# Altium schematic sheet 3.3V_REG_EN.SchDoc
size A4
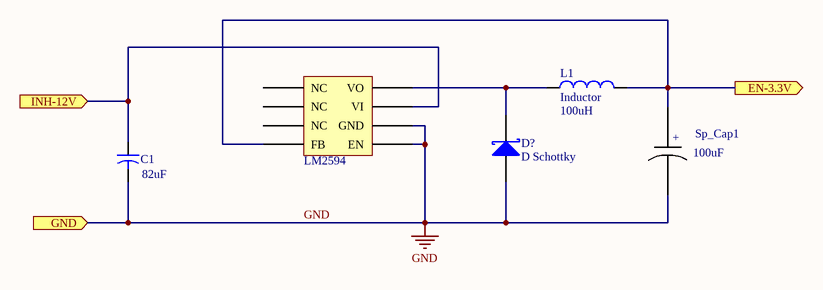
[diagram p0: 3.3V_REG_EN.SchDoc]

## Parts
C1  value 82uF  [CAPR5-4X5]  (hidden comment: Cap2)
D?  D Schottky  [SMB]
L1  Inductor  value 100uH  [0402-A]
LM2594  LM2594  [SOIC8-LM2594]  (value not drawn)
Sp_Cap1  value 100uF  (hidden comment: Sprague_capacitor)

## Ports
EN-3.3V (out), GND (in), INH-12V (in)

## Nets
GND: C1.2 D?.1(A) LM2594.EN LM2594.GND Sp_Cap1.?2 ; port GND
EN-3.3V: L1.2 LM2594.FB Sp_Cap1.?1 ; port EN-3.3V
INH-12V: C1.1 LM2594.VI ; port INH-12V
NetD?_2: D?.2(K) L1.1 LM2594.VO

Not connected (* = marked no-connect by the designer): LM2594 NC

## Notes on the sheet
- (in symbol Sprague_capacitor) +

## Library data of the parts
C1 = Cap2: Capacitor; Published: 23-Sep-2002; PackageReference: CAPR5-4X5; Publisher: Altium Limited; PackageDescription: Capacitor; 2 Leads
D? = D Schottky: Schottky Diode; Published: 8-Jun-2000; LatestRevisionDate: 17-Jul-2002; LatestRevisionNote: Re-released for DXP Platform.; PackageReference: SMB; Publisher: Altium Limited; PackageDescription: DO-214-AA/SMB; 2 C-Bend Leads; Body 5.3 x 3.6 mm, inc. leads (LxW); Code_JEDEC: DO-214-AA
L1 = Inductor: Code_IEC: 1005; Published: 8-Jun-2000; LatestRevisionDate: 29-May-2009; LatestRevisionNote: IPC-7351 Footprint Added.; PackageReference: 0402-A; Publisher: Altium Limited; PackageDescription: Chip Inductor; Code_JEITA: 0402
LM2594 = LM2594: 3.3 Step-down (0.5A); HelpURL: http://www.ti.com/lit/ds/symlink/lm2594.pdf
Sp_Cap1 = Sprague_capacitor: Sprague Tantalum Capacitor; HelpURL: http://www.mouser.es/ProductDetail/Vishay-Sprague/594D686X0010C2T/?qs=sGAEpiMZZMuEN2agSAc2pn0KQ7q64aCR6Bnog1kvSjk%3d